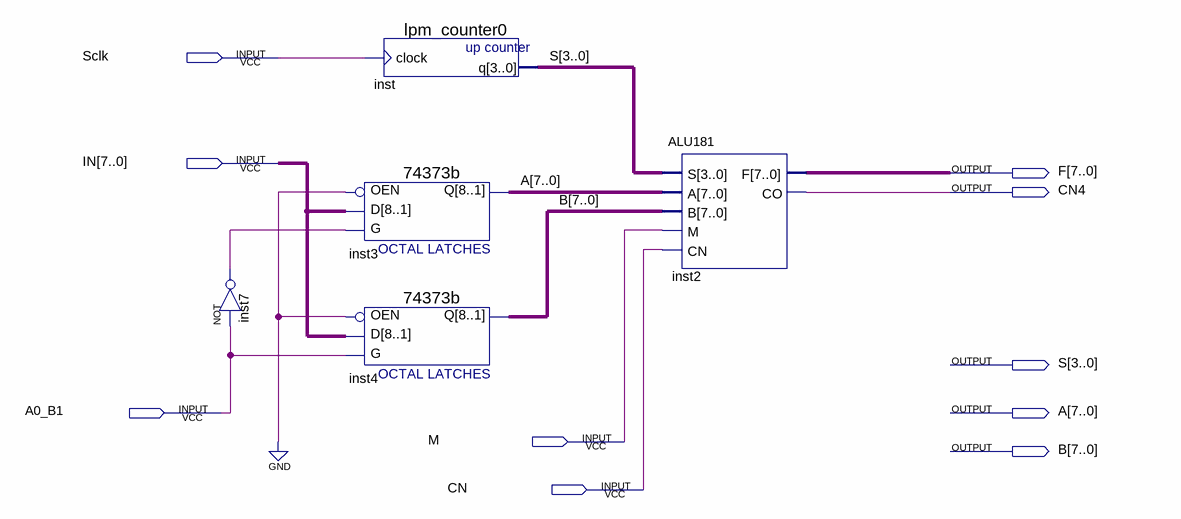
[diagram p0: schematic sheet]
// Quartus schematic alu.bdf as structural Verilog: 5 symbols, 10 pins
module alu (
  input  Sclk,
  input  [7:0] IN,
  input  A0_B1,
  input  M,
  input  CN,
  output [7:0] F,
  output CN4,
  output [3:0] S,
  output [7:0] A,
  output [7:0] B
);

  wire inst7_out;

  not inst7 (inst7_out, A0_B1);
  lpm_counter0 inst (.clock(Sclk), .q(S));
  \74373b  inst3 (.D(IN), .G(inst7_out), .OEN(1'b0), .Q(A));
  \74373b  inst4 (.D(IN), .G(A0_B1), .OEN(1'b0), .Q(B));
  ALU181 inst2 (.S(S), .A(A), .B(B), .M(M), .CN(CN), .F(F), .CO(CN4));
endmodule
